# Altium schematic sheet Power_Source.SchDoc
size B; SheetNumber: 2; SheetTotal: 5
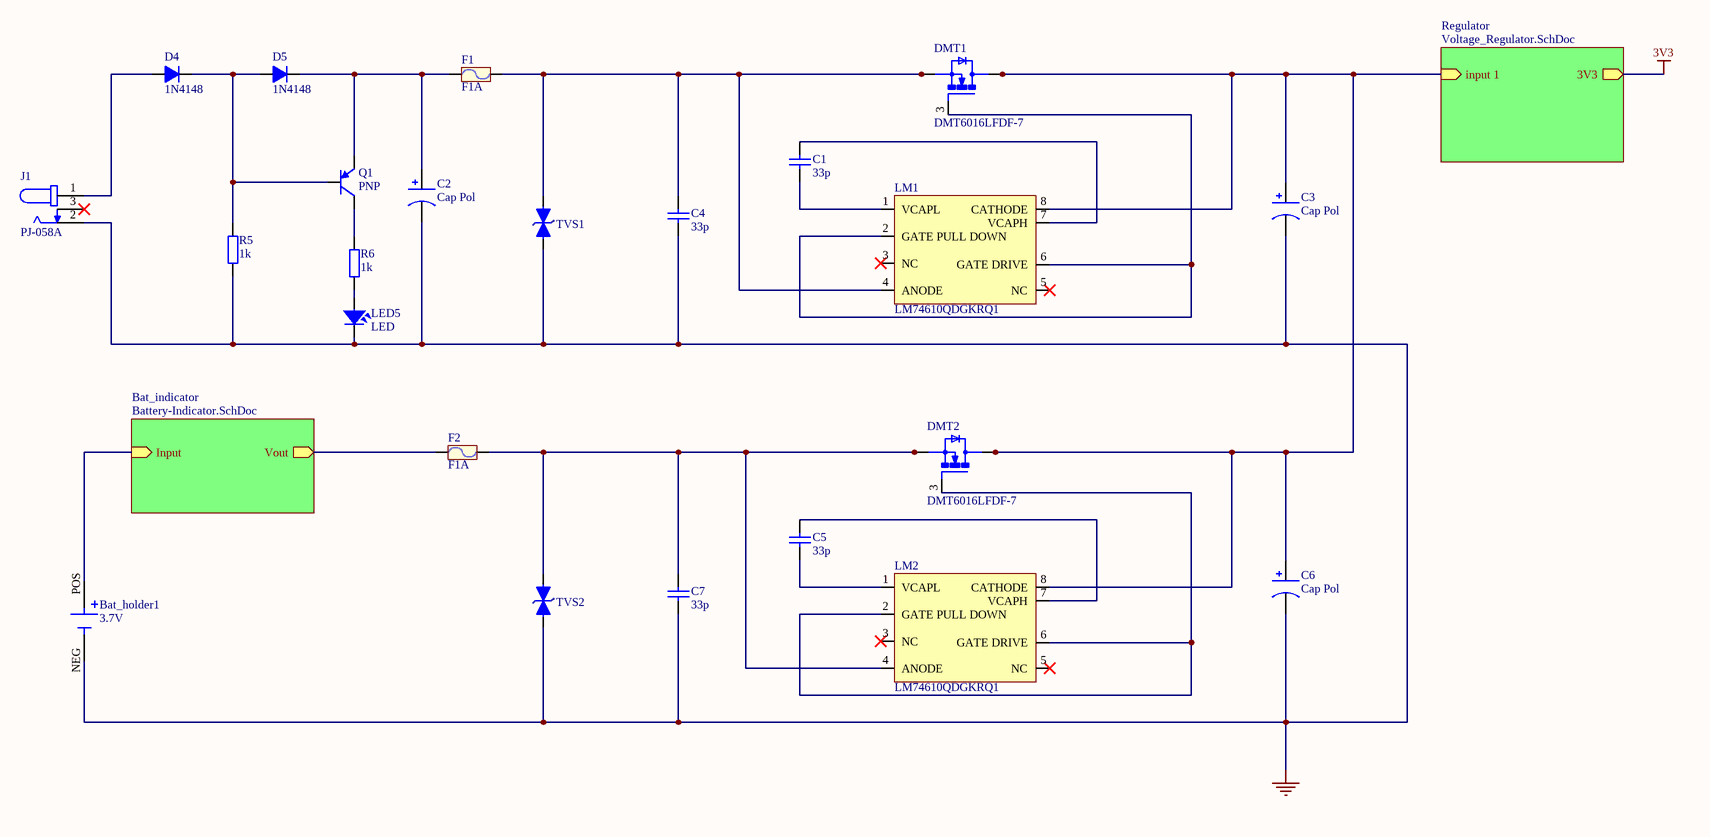
[diagram p0: Power_Source.SchDoc]

## Parts
Bat_holder1  3.7V  [BAT_BK-18650-PC2]
C1  value 33p  [CAP_CERAMIC]  (hidden comment: Capacitor Ceramic)
C2  Cap Pol  [C3MM]
C3  Cap Pol  [C3MM]
C4  value 33p  [CAP_CERAMIC]  (hidden comment: Capacitor Ceramic)
C5  value 33p  [CAP_CERAMIC]  (hidden comment: Capacitor Ceramic)
C6  Cap Pol  [C3MM]
C7  value 33p  [CAP_CERAMIC]  (hidden comment: Capacitor Ceramic)
D4  1N4148  [D0.5A]
D5  1N4148  [D0.5A]
DMT1  DMT6016LFDF-7  [TRANS_DMT6016LFDF-7]
DMT2  DMT6016LFDF-7  [TRANS_DMT6016LFDF-7]
F1  F1A  [Fuse]
F2  F1A  [Fuse]
J1  PJ-058A  [CUI_PJ-058A]
LED5  LED  [LED-3]
LM1  LM74610QDGKRQ1  [SOP65P490X110-8N]
LM2  LM74610QDGKRQ1  [SOP65P490X110-8N]
Q1  PNP  [TRAN-LOWPOWER]
R5  1k  [RES_0805]
R6  1k  [RES_0805]
TVS1  TVS  [CN4]  (value not drawn)
TVS2  TVS  [CN4]  (value not drawn)

## Sub-sheets
Bat_indicator = Battery-Indicator.SchDoc: Input (in), Vout (out)
Regulator = Voltage_Regulator.SchDoc: 3V3 (out), input 1 (in)

## Nets
3V3: sheet Regulator/3V3
GND: Bat_holder1.NEG C2.2 C3.2 C4.1 C6.2 C7.1 J1.2 LED5.2 R5.1 TVS1.2 TVS2.2
NetBat_holder1_POS: Bat_holder1.POS ; sheet Bat_indicator/Input
NetC1_1: C1.1 LM1.1(VCAPL)
NetC1_2: C1.2 LM1.7(VCAPH)
NetC2_1: C2.1 D5.2(K) F1.1 Q1.1(E)
NetC3_1: C3.1 C6.1 DMT1.1(D) DMT1.2(D) DMT1.5(D) DMT1.6(D) DMT1.8(D) DMT2.1(D) DMT2.2(D) DMT2.5(D) DMT2.6(D) DMT2.8(D) LM1.8(CATHODE) LM2.8(CATHODE) ; sheet Regulator/input 1
NetC4_2: C4.2 DMT1.4(S) DMT1.7(S) F1.2 LM1.4(ANODE) TVS1.1
NetC5_1: C5.1 LM2.1(VCAPL)
NetC5_2: C5.2 LM2.7(VCAPH)
NetC7_2: C7.2 DMT2.4(S) DMT2.7(S) F2.2 LM2.4(ANODE) TVS2.1
NetD4_1: D4.1(A) J1.1
NetD4_2: D4.2(K) D5.1(A) Q1.3(B) R5.2
NetDMT1_3: DMT1.3(G) LM1.2(GATE_PULL_DOWN) LM1.6(GATE_DRIVE)
NetDMT2_3: DMT2.3(G) LM2.2(GATE_PULL_DOWN) LM2.6(GATE_DRIVE)
NetF2_1: F2.1 ; sheet Bat_indicator/Vout
NetLED5_1: LED5.1 R6.1
NetQ1_2: Q1.2(C) R6.2

Not connected (* = marked no-connect by the designer): J1 3*; LM1 3(NC)* 5(NC)*; LM2 3(NC)* 5(NC)*

## Library data of the parts
Bat_holder1 = BK-18650-PC2: Battery Holder (Open) 18650 1 Cell PC Pin; Price: None; Value: *; Package: None; Availability: Unavailable; MP: BK-18650-PC2
C1 C4 C5 C7 = CapCeramic: Capacitor; Published: 8-Jun-2000; LatestRevisionDate: 17-Jul-2002; LatestRevisionNote: Re-released for DXP Platform.; PackageReference: RAD-0.3; Publisher: Altium Limited
C2 C3 C6 = Cap Pol: Polarized Capacitor (Axial); Published: 8-Jun-2000; LatestRevisionDate: 17-Jul-2002; LatestRevisionNote: Re-released for DXP Platform.; PackageReference: POLAR0.8; Publisher: Altium Limited
D4 D5 = D0.5A: Value: 1N4148
DMT1 DMT2 = DMT6016LFDF-7: Transistor, 60V, N-channel, enhancement mode MOSFET, 60V, U-DFN2020-6 | Diodes Inc DMT6016LFDF-7; MF: Diodes Inc.; SnapEDA_Link: https://www.snapeda.com/parts/DMT6016LFDF-7/Diodes+Inc./view-part/?ref=snap; Package: UDFN-6 Diodes Inc.; Value: *; MP: DMT6016LFDF-7; Check_prices: https://www.snapeda.com/parts/DMT6016LFDF-7/Diodes+Inc./view-part/?ref=eda
F1 F2 = Fuse: Designed by: VanDungEvn; Value: Fuse
J1 = PJ-058A: 2.0 x 5.7 mm, 2.5 A, Horizontal, Through Hole, Locking Type, Dc Power Jack Connector; MF: Same Sky; SnapEDA_Link: https://www.snapeda.com/parts/PJ-058A/Same+Sky/view-part/?ref=snap; Package: None; Value: *; MP: PJ-058A; Check_prices: https://www.snapeda.com/parts/PJ-058A/Same+Sky/view-part/?ref=eda
LED5 = LED: LED Single colour Green and Red; Value: LED 3 ly Single Colour
LM1 LM2 = LM74610QDGKRQ1: 0.48-V to 42-V, zero IQ automotive ideal diode controller 8-VSSOP -40 to 125; Manufacturer: Texas Instruments; Quiescent Current: 0pA; Operating Supply Current: 0A; Supplier 1: Mouser; Manufacturer Part Number: LM74610QDGKRQ1; RoHS: Yes; Category: Power Management ICs; Stock 1: 3008; Pricing 1: 1=2.07, 10=1.54, 50=1.4, 100=1.25, 1000=1.1, 10000=1.01 (USD); Mount: Surface Mount; Case/Package: VSSOP; Number of Pins: 8; Weight: 0.005997oz; Min Operating Temperature: -40°C; Max Operating Temperature: 125°C; Series: Automotive, AEC-Q100; Packaging: Cut Tape; Package Quantity: 2500; Lead Free: Lead Free; RoHS Compliant: Yes; ComponentLink1URL: http://www.ti.com/lit/ds/symlink/lm74610-q1.pdf?src-supplier=Digikey; ComponentLink1Description: http://www.ti.com/lit/ds/symlink/lm74610-q1.pdf?src-supplier=Digikey; Supplier Part Number 1: 595-LM74610QDGKRQ1
Q1 = PNP: PNP General; Published: 8-Jun-2000; LatestRevisionDate: 15-Jan-2003; LatestRevisionNote: PCB Footprint 'BCY-W3/D4.7' replaced; DatasheetDocument: 1997; PackageDocument: Sep-1998; PackageReference: TO-92A; Publisher: Altium Limited; Code_JEDEC: TO-92A; ComponentLink1Description: Manufacturer Link; ComponentLink1URL: http://www.fairchildsemi.com/; ComponentLink2Description: Datasheet; ComponentLink2URL: http://www.fairchildsemi.com/ds/2N%2F2N3906.pdf
R5 R6 = RES_0805: Resistor SMD 0805; Manufacturer: *; Manufacturer Part Number: *; Distributor Link: *; LCSC: *
TVS1 TVS2 = TVS: Generic TVS Diode; Value: Zenner Protect AC input